# Altium schematic sheet MMC-CAN.SchDoc: MMC-CAN
size A4
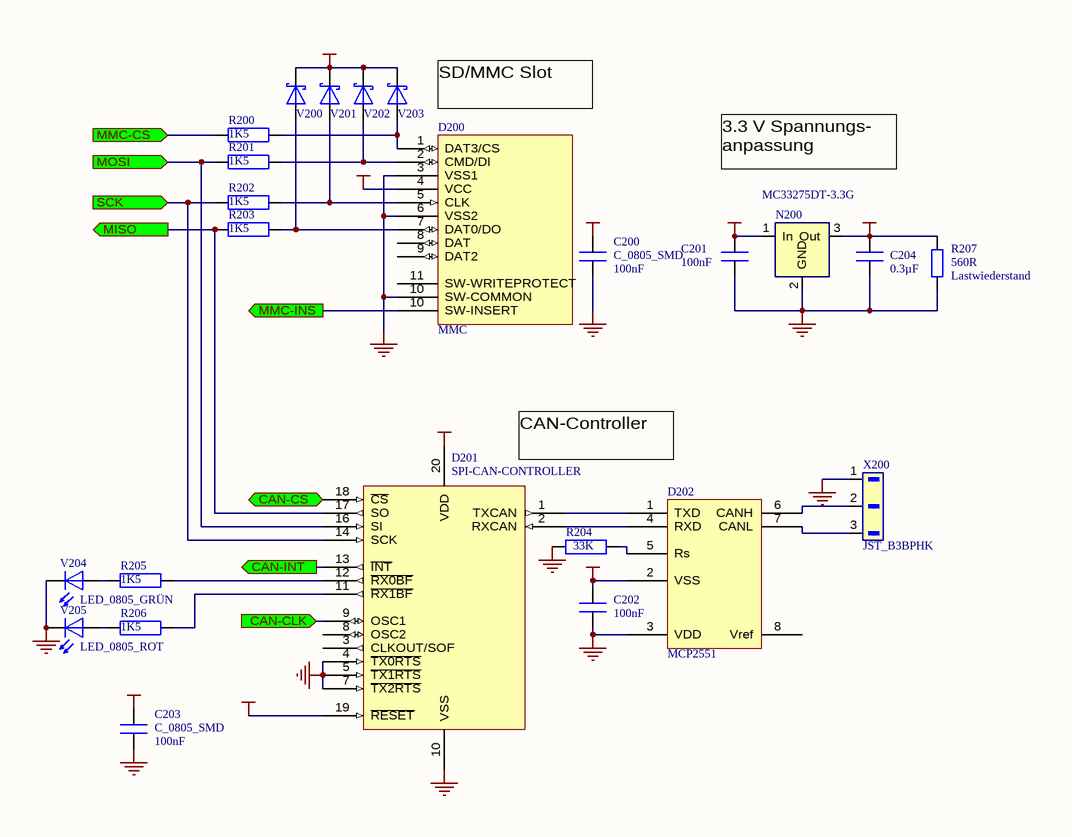
[diagram p0: MMC-CAN.SchDoc]

## Parts
C200  C_0805_SMD  [0805_R]
C201  C_0805_SMD  [0805_R]  (value not drawn)
C202  C_0805_SMD  [0805_R]  (value not drawn)
C203  C_0805_SMD  [0805_R]
C204  C_1206_SMD  [1206_R]  (value not drawn)
D200  MMC
D201  SPI-CAN-CONTROLLER
D202  MCP2551
N200  MC33275DT-3.3G  [DPAK_R]
R200  R_0805_SMD  [0805_R]  (value not drawn)
R201  R_0805_SMD  [0805_R]  (value not drawn)
R202  R_0805_SMD  [0805_R]  (value not drawn)
R203  R_0805_SMD  [0805_R]  (value not drawn)
R204  R_0805_SMD  [0805_R]  (value not drawn)
R205  R_0805_SMD  [0805_R]  (value not drawn)
R206  R_0805_SMD  [0805_R]  (value not drawn)
R207  Lastwiederstand  value 560R  [CR2012-0805]
V200  SCHOTTKY_SMC_SMD  [CR2012-0805]  (value not drawn)
V201  SCHOTTKY_SMC_SMD  [CR2012-0805]  (value not drawn)
V202  SCHOTTKY_SMC_SMD  [CR2012-0805]  (value not drawn)
V203  SCHOTTKY_SMC_SMD  [CR2012-0805]  (value not drawn)
V204  LED_0805_GRÜN  [0805_R]
V205  LED_0805_ROT  [0805_R]
X200  JST_B3BPHK  [B3BPHK]

## Ports
CAN-CLK (in), CAN-CS (in), CAN-INT (out), MISO (out), MMC-CS (in), MMC-INS (out), MOSI (in), SCK (in)

## Nets
GND: C200.1 C201.2 C202.1 C203.1 C204.1 D200.3(VSS1) D200.6(VSS2) D200.10(SW-COMMON) D201.4(~{TX0RTS}) D201.5(~{TX1RTS}) D201.7(~{TX2RTS}) D201.10(VSS) D202.3(VDD) N200.2(GND) R204.1 R207.2 V204.2(K) V205.2(K) X200.1
VCC: C200.2 C201.1 C202.2 C203.2 D201.19(~{RESET}) D201.20(VDD) D202.2(VSS) N200.1(In)
VCC3V: C204.2 D200.4(VCC) N200.3(Out) R207.1 V200.2(K) V201.2(K) V202.2(K) V203.2(K)
CAN-CLK: D201.9(OSC1) ; port CAN-CLK
CAN-CS: D201.18(~{CS}) ; port CAN-CS
CAN-INT: D201.13(~{INT}) ; port CAN-INT
MISO: D201.17(SO) R203.1 ; port MISO
MMC-CS: R200.1 ; port MMC-CS
MMC-INS: D200.10(SW-INSERT) ; port MMC-INS
MOSI: D201.16(SI) R201.1 ; port MOSI
SCK: D201.14(SCK) R202.1 ; port SCK
NetD200_1: D200.1(DAT3/CS) R200.2 V203.1(A)
NetD200_2: D200.2(CMD/DI) R201.2 V202.1(A)
NetD200_5: D200.5(CLK) R202.2 V201.1(A)
NetD200_7: D200.7(DAT0/DO) R203.2 V200.1(A)
NetD201_1: D201.1(TXCAN) D202.1(TXD)
NetD201_2: D201.2(RXCAN) D202.4(RXD)
NetD201_11: D201.11(~{RX1BF}) R206.2
NetD201_12: D201.12(~{RX0BF}) R205.2
NetD202_5: D202.5(Rs) R204.2
NetD202_6: D202.6(CANH) X200.2
NetD202_7: D202.7(CANL) X200.3
NetR205_1: R205.1 V204.1(A)
NetR206_1: R206.1 V205.1(A)

Not connected (* = marked no-connect by the designer): D200 8(DAT) 9(DAT2) 11(SW-WRITEPROTECT); D201 3(CLKOUT/SOF) 8(OSC2); D202 8(Vref)

## Notes on the sheet
- SD/MMC Slot
- 3.3 V Spannungs- anpassung
- (near D201) CAN-Controller
- (in symbol C_0805_SMD) 100nF
- (in symbol C_1206_SMD) 0.3µF
- (in symbol R_0805_SMD) 1K5; 33K

## Library data of the parts
C200-C203 = C_0805_SMD: Kondensator in SMD-Bauform
C204 = C_1206_SMD: Kondensator in SMD-Bauform
D201 = MCP2515
N200 = MC33275DT-3.3G_SMD: MC33275DT-3.3G_SMD_3.3V Festspannungsregler positiv
R200-R206 = R_0805_SMD: Widerstand
R207 = Res2: Resistor; Published: 8-Jun-2000; Revision: July-2002: Re-released for DXP Platform.; Publisher: Altium Limited
V200-V203 = SCHOTTKY_SMC_SMD: SCHOTTKY-Diode_SMC_SMD
V204 V205 = LED_0805_SMD: Leuchtdiode_SMD_0805
X200 = JST_B3BPHK: Buchse_3-polig